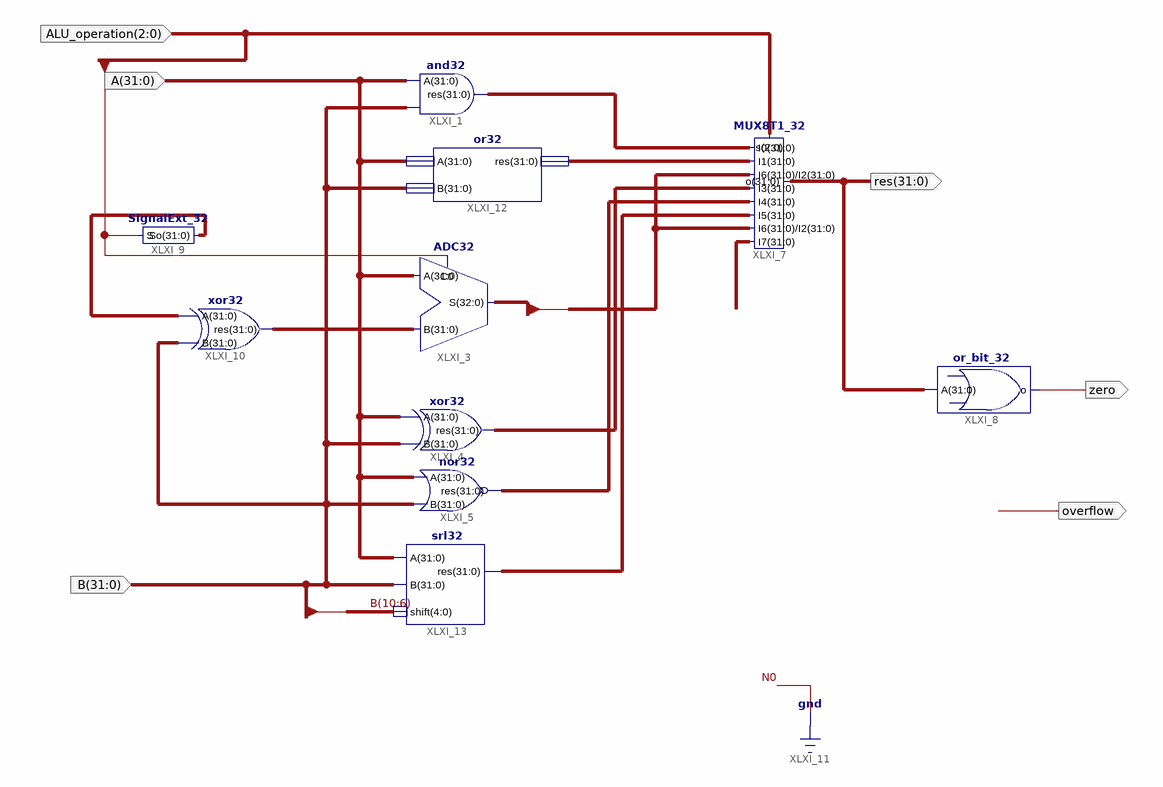
[diagram p0: schematic sheet 1]
// Xilinx ISE schematic alu.sch (kintex7) as structural Verilog: 10 symbols, 6 ports
module alu (
  input  [31:0] B,
  input  [2:0] ALU_operation,
  input  [31:0] A,
  output [31:0] res,
  output zero,
  output overflow
);

  wire [31:0] XLXN_3, XLXN_5, XLXN_7, XLXN_10, XLXN_11, XLXN_12, XLXN_13;
  wire [32:0] S;

  and32 XLXI_1 (.res(XLXN_7), .A(A), .B(B));
  ADC32 XLXI_3 (.B(XLXN_3), .A(A), .C0(ALU_operation[2]), .S(S));
  xor32 XLXI_4 (.A(A), .B(B), .res(XLXN_10));
  nor32 XLXI_5 (.res(XLXN_11), .A(A), .B(B));
  MUX8T1_32 XLXI_7 (
    .s(ALU_operation), .I7({32{1'b0}}), .I6(S[31:0]), .I5(XLXN_13), .I4(XLXN_11), .I3(XLXN_10), .I2(S[31:0]),
    .I1(XLXN_12), .I0(XLXN_7), .o(res));
  or_bit_32 XLXI_8 (.o(zero), .A(res));
  SignalExt_32 XLXI_9 (.So(XLXN_5), .S(ALU_operation[2]));
  xor32 XLXI_10 (.A(XLXN_5), .B(B), .res(XLXN_3));
  or32 XLXI_12 (.A(A), .B(B), .res(XLXN_12));
  srl32 XLXI_13 (.A(A), .B(B), .res(XLXN_13), .shift(B[10:6]));
endmodule
